# Altium schematic sheet Boost Converter 6V.SchDoc
size A4; DrawnBy: Lorna Lan; DocumentNumber: 14; Revision: v4.2; SheetNumber: 14; SheetTotal: 20
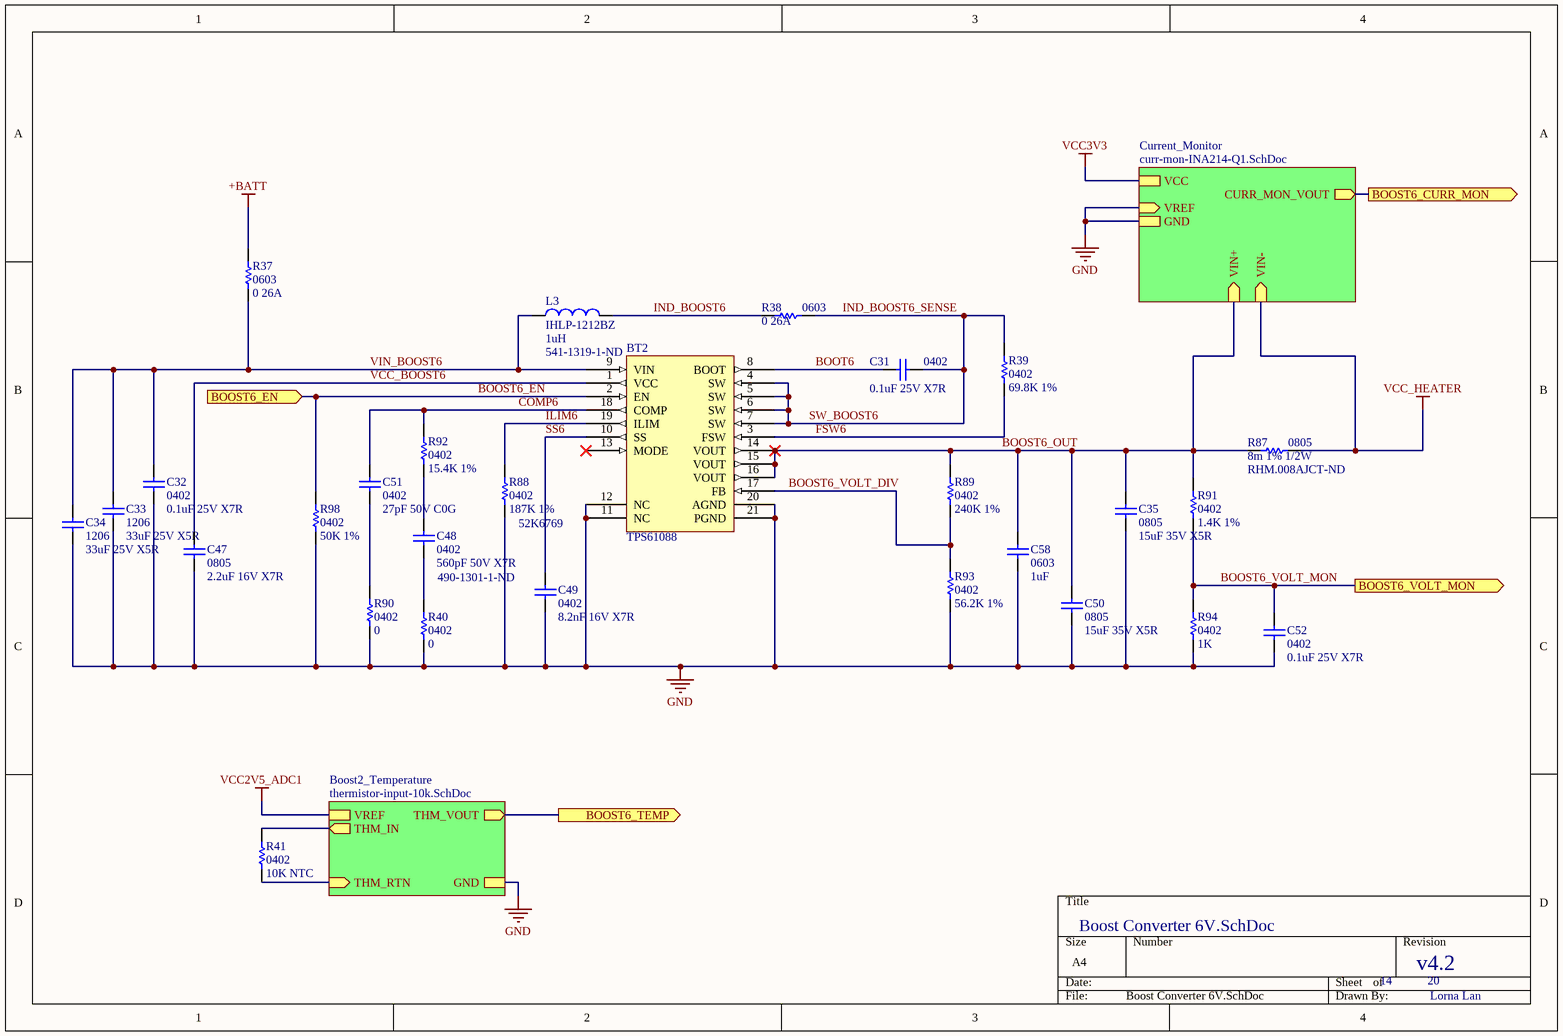
[diagram p0: Boost Converter 6V.SchDoc]

## Parts
BT2  TPS61088  [QFN50P450X350X100-21N]
C31  0402  value 0.1uF 25V X7R  [CAP0402R]
C32  0402  value 0.1uF 25V X7R  [CAP0402R]
C33  1206  value 33uF 25V X5R  [CAP1206R]
C34  1206  value 33uF 25V X5R  [CAP1206R]
C35  0805  value 15uF 35V X5R  [CAP0805R]
C47  0805  value 2.2uF 16V X7R  [CAP0805R]
C48  0402  value 560pF 50V X7R  Supplier Part Number 1: 490-1301-1-ND  [CAP0402R]
C49  0402  value 8.2nF 16V X7R  [CAP0402R]
C50  0805  value 15uF 35V X5R  [CAP0805R]
C51  0402  value 27pF 50V C0G  [CAP0402R]
C52  0402  value 0.1uF 25V X7R  [CAP0402R]
C58  0603  value 1uF  [CAP0603R]
L3  IHLP-1212BZ  Inductance: 1uH  Supplier Part Number 1: 541-1319-1-ND  [IHLP-1212BZ]
R37  0603  value 0 26A  [RES0603R]
R38  0603  value 0 26A  [RES0603R]
R39  0402  value 69.8K 1%  [RES0402R]
R40  0402  value 0  [RES0402R]
R41  0402  value 10K NTC  [RES0402R]
R87  0805  value 8m 1% 1/2W  Supplier Part Number 1: RHM.008AJCT-ND  [RES0805R]
R88  0402  value 187K 1%  Supplier Part Number 1: 52K6769  [RES0402R]
R89  0402  value 240K 1%  [RES0402R]
R90  0402  value 0  [RES0402R]
R91  0402  value 1.4K 1%  [RES0402R]
R92  0402  value 15.4K 1%  [RES0402R]
R93  0402  value 56.2K 1%  [RES0402R]
R94  0402  value 1K  [RES0402R]
R98  0402  value 50K 1%  [RES0402R]

## Sub-sheets
Boost2_Temperature = thermistor-input-10k.SchDoc: GND, VREF, THM_RTN (in), THM_IN (out), THM_VOUT (out)
Current_Monitor = curr-mon-INA214-Q1.SchDoc: VCC, VREF (in), VIN+ (in), GND, VIN- (in), CURR_MON_VOUT (out)

## Ports
BOOST6_CURR_MON (out), BOOST6_EN (in), BOOST6_TEMP (out), BOOST6_VOLT_MON (out)

## Nets
+BATT: R37.2
GND: BT2.11(NC) BT2.12(NC) BT2.20(AGND) BT2.21(PGND) C32.1 C33.1 C34.1 C35.1 C47.1 C49.1 C50.1 C52.1 C58.1 R40.1 R88.1 R90.1 R93.1 R94.1 R98.1 ; sheet Boost2_Temperature/GND, sheet Current_Monitor/VREF, sheet Current_Monitor/GND
VCC2V5_ADC1: sheet Boost2_Temperature/VREF
VCC3V3: sheet Current_Monitor/VCC
VCC_HEATER: R87.2 ; sheet Current_Monitor/VIN-
BOOST6_CURR_MON: port BOOST6_CURR_MON, sheet Current_Monitor/CURR_MON_VOUT
BOOST6_EN: BT2.2(EN) R98.2 ; port BOOST6_EN
BOOST6_OUT: BT2.14(VOUT) BT2.15(VOUT) BT2.16(VOUT) C35.2 C50.2 C58.2 R87.1 R89.2 R91.2 ; sheet Current_Monitor/VIN+
BOOST6_TEMP: port BOOST6_TEMP, sheet Boost2_Temperature/THM_VOUT
BOOST6_VOLT_DIV: BT2.17(FB) R89.1 R93.2
BOOST6_VOLT_MON: C52.2 R91.1 R94.2 ; port BOOST6_VOLT_MON
BOOT6: BT2.8(BOOT) C31.1
COMP6: BT2.18(COMP) C51.2 R92.2
FSW6: BT2.3(FSW) R39.1
ILIM6: BT2.19(ILIM) R88.2
IND_BOOST6: L3.2 R38.1
IND_BOOST6_SENSE: BT2.4(SW) BT2.5(SW) BT2.6(SW) BT2.7(SW) C31.2 R38.2 R39.2  [also labelled SW_BOOST6]
SS6: BT2.10(SS) C49.2
VCC_BOOST6: BT2.1(VCC) C47.2
VIN_BOOST6: BT2.9(VIN) C32.2 C33.2 C34.2 L3.1 R37.1
NetC48_1: C48.1 R40.2
NetC48_2: C48.2 R92.1
NetC51_1: C51.1 R90.2
NetR41_1: R41.1 ; sheet Boost2_Temperature/THM_RTN
NetR41_2: R41.2 ; sheet Boost2_Temperature/THM_IN

Not connected (* = marked no-connect by the designer): BT2 13(MODE)*

## Library data of the parts
BT2 = TPS61088: Boost converter; Supplier 1: Digi-Key; Supplier Part Number 1: 296-42129-1-ND
C31 C32 C48 C49 C51 C52 = CAP0402: 0402 capacitor
  C48: Supplier 1: Digi-Key
  C49: Supplier 1: Digi-Key; Supplier Part Number 1: 490-6338-1-ND
  C51: Supplier 1: Digi-Key; Supplier Part Number 1: 490-5869-1-ND
C33 C34 = CAP1206: 1206 capacitor; Supplier 1: Digi-Key; Supplier Part Number 1: 445-8046-1-ND
C35 C47 C50 = CAP0805: 0805 capacitor
  C35 C50: Supplier 1: Mouser; Supplier Part Number 1: 810-C2012X5R1V156M1C
  C47: Supplier 1: Digi-Key; Supplier Part Number 1: 490-3906-1-ND
C58 = CAP0603: 0603 capacitor; Manufacturer: KEMET; Manufacturer Part Number: C0603C105K4RACAUTO; Tolerance: 10%; Voltage Rating: 16V; Supplier 1: Digi-Key; Supplier Part Number 1: 399-17704-1-ND; Stock 1: 376276; Pricing 1: 1=0.17, 10=0.12, 100=0.0564, 500=0.03952, 1000=0.03273 (USD); Mount: Surface Mount; Case/Package: 0603; Case Code (Imperial): 0603; Case Code (Metric): 1608; Min Operating Temperature: -55°C; Max Operating Temperature: 125°C; Packaging: Cut Tape; Capacitance: 1uF; Ratings: AEC-Q200; Supplier 2: Digi-Key; Supplier Part Number 2: 587-3467-1-ND
L3 = IND_IHLP-1212BZ: 1µH Shielded Molded Inductor 5A 24mOhm Max Nonstandard; Manufacturer: Vishay Dale; Manufacturer Part Number: IHLP1212BZER1R0M11; Core Material: Metal,Composite; Self Resonant Frequency: 75MHz; Saturation Current: 4.5A; Tolerance: 20%; DC Resistance (DCR): 24mR; Test Frequency: 100kHz; Supplier 1: Digi-Key; Stock 1: 196362; Pricing 1: 1=1.45, 10=1.346, 100=0.9729, 500=0.7452, 1000=0.6624 (USD); Mount: Surface Mount; Case/Package: 1212; Number of Pins: 2; Case Code (Metric): 3630; Case Code (Imperial): 1212; Contact Plating: Tin; Min Operating Temperature: -55°C; Max Operating Temperature: 125°C; Shielding: Shielded; Packaging: Tape and Reel; Package Quantity: 3000; Current Rating: 5A; Inductance Tolerance: 20%; Max DC Current: 5A; Termination: SMD/SMT; RMS Current (Irms): 5A; Military Standard: Not; Length: 3.6mm; Height: 2mm; Width: 0.118inch; Height - Seated (Max): 0.079inch; Depth: 3.2mm; Radiation Hardening: No; REACH SVHC: Unknown; Lead Free: Lead Free; ComponentLink1URL: http://www.mouser.com/ds/2/427/lp12bz11-244380.pdf?src-supplier=Mouser; ComponentLink1Description: http://www.mouser.com/ds/2/427/lp12bz11-244380.pdf?src-supplier=Mouser; ComponentLink2URL: http://www.vishay.com/docs/34289/lp12bz11.pdf?src-supplier=Digi-Key; ComponentLink2Description: http://www.vishay.com/docs/34289/lp12bz11.pdf?src-supplier=Digi-Key; ComponentLink3URL: http://www.vishay.com/docs/34289/lp12bz11.pdf?src-supplier=Avnet; ComponentLink3Description: http://www.vishay.com/docs/34289/lp12bz11.pdf?src-supplier=Avnet; ComponentLink4URL: http://www.farnell.com/datasheets/652599.pdf?src-supplier=Element14; ComponentLink4Description: http://www.farnell.com/datasheets/652599.pdf?src-supplier=Element14; ComponentLink5URL: http://www.vishay.com/docs/34289/lp12bz11.pdf?src-supplier=Avnet+Europe; ComponentLink5Description: http://www.vishay.com/docs/34289/lp12bz11.pdf?src-supplier=Avnet+Europe; ComponentLink6URL: https://www.verical.com/server-webapp/html/getDatasheet?partID=180380&src-supplier=Verical; ComponentLink6Description: https://www.verical.com/server-webapp/html/getDatasheet?partID=180380&src-supplier=Verical
R37 R38 = RES0603: 0603 resistor; Supplier 1: Digi-Key; Supplier Part Number 1: 2019-TLRZ1JTTDCT-ND
R39 R41 R88 R89 R91-R94 R98 = RES0402: 0402 resistor
  R39: Supplier 1: Digi-Key; Supplier Part Number 1: 541-69.8KLCT-ND
  R88: Supplier 1: Newark
  R89 R93: Supplier 1: Digi-Key; Supplier Part Number 1: 541-118KLCT-ND
  R94: Supplier 1: Digi-Key; Supplier Part Number 1: YAG1234CT-ND
R40 R90 = RES0402: 0402 resistor; Manufacturer: Panasonic; Manufacturer Part Number: ERJ-2GE0R00X; Resistance: 0mR; Power Rating: 100mW; Voltage Rating: 50V; Tolerance: 5%; Temperature Coefficient: 600ppm/°C; Supplier 1: Digi-Key; Supplier Part Number 1: P0.0JCT-ND; Stock 1: 47740000; Pricing 1: 1=0.1, 10=0.03, 25=0.0216, 50=0.0164, 100=0.0121, 250=0.00924, 500=0.0074, 1000=0.00545, 5000=0.00391 (USD); Mount: Surface Mount; Case/Package: 0402; Case Code (Metric): 1005; Case Code (Imperial): 0402; Contact Plating: Tin; Min Operating Temperature: -55°C; Max Operating Temperature: 155°C; Packaging: Tape and Reel; Package Quantity: 1; Composition: Thick Film; Number of Terminations: 2; Termination: SMD/SMT; Military Standard: Not; Max Power Dissipation: 100mW; Voltage Rating (DC): 50V; Features: Automotive AEC-Q200; Length: 1mm; Height: 0.35mm; Width: 0.02inch; Depth: 0.5mm; Radiation Hardening: No; REACH SVHC: No SVHC; Lead Free: Lead Free; ComponentLink1URL: http://industrial.panasonic.com/www-data/pdf/AOA0000/AOA0000CE1.pdf?src-supplier=Avnet; ComponentLink1Description: http://industrial.panasonic.com/www-data/pdf/AOA0000/AOA0000CE1.pdf?src-supplier=Avnet; ComponentLink2URL: http://www.alliedelec.com/m/d/51cd0790071e1666bdb9d00c57fcf960.pdf?src-supplier=Allied+Electronics; ComponentLink2Description: http://www.alliedelec.com/m/d/51cd0790071e1666bdb9d00c57fcf960.pdf?src-supplier=Allied+Electronics; ComponentLink3URL: http://industrial.panasonic.com/www-data/pdf/AOA0000/AOA0000CE1.pdf?src-supplier=Avnet+Europe; ComponentLink3Description: http://industrial.panasonic.com/www-data/pdf/AOA0000/AOA0000CE1.pdf?src-supplier=Avnet+Europe; ComponentLink4URL: http://www.farnell.com/datasheets/2059623.pdf?src-supplier=Farnell; ComponentLink4Description: http://www.farnell.com/datasheets/2059623.pdf?src-supplier=Farnell; ComponentLink5URL: http://www.farnell.com/datasheets/2059623.pdf?src-supplier=Element14; ComponentLink5Description: http://www.farnell.com/datasheets/2059623.pdf?src-supplier=Element14; ComponentLink6URL: http://www.farnell.com/datasheets/1678796.pdf?src-supplier=Element14; ComponentLink6Description: http://www.farnell.com/datasheets/1678796.pdf?src-supplier=Element14
R87 = RES0805: 0805 resistor; Supplier 1: Digi-Key